# Altium project MKSCANable.PrjPcb
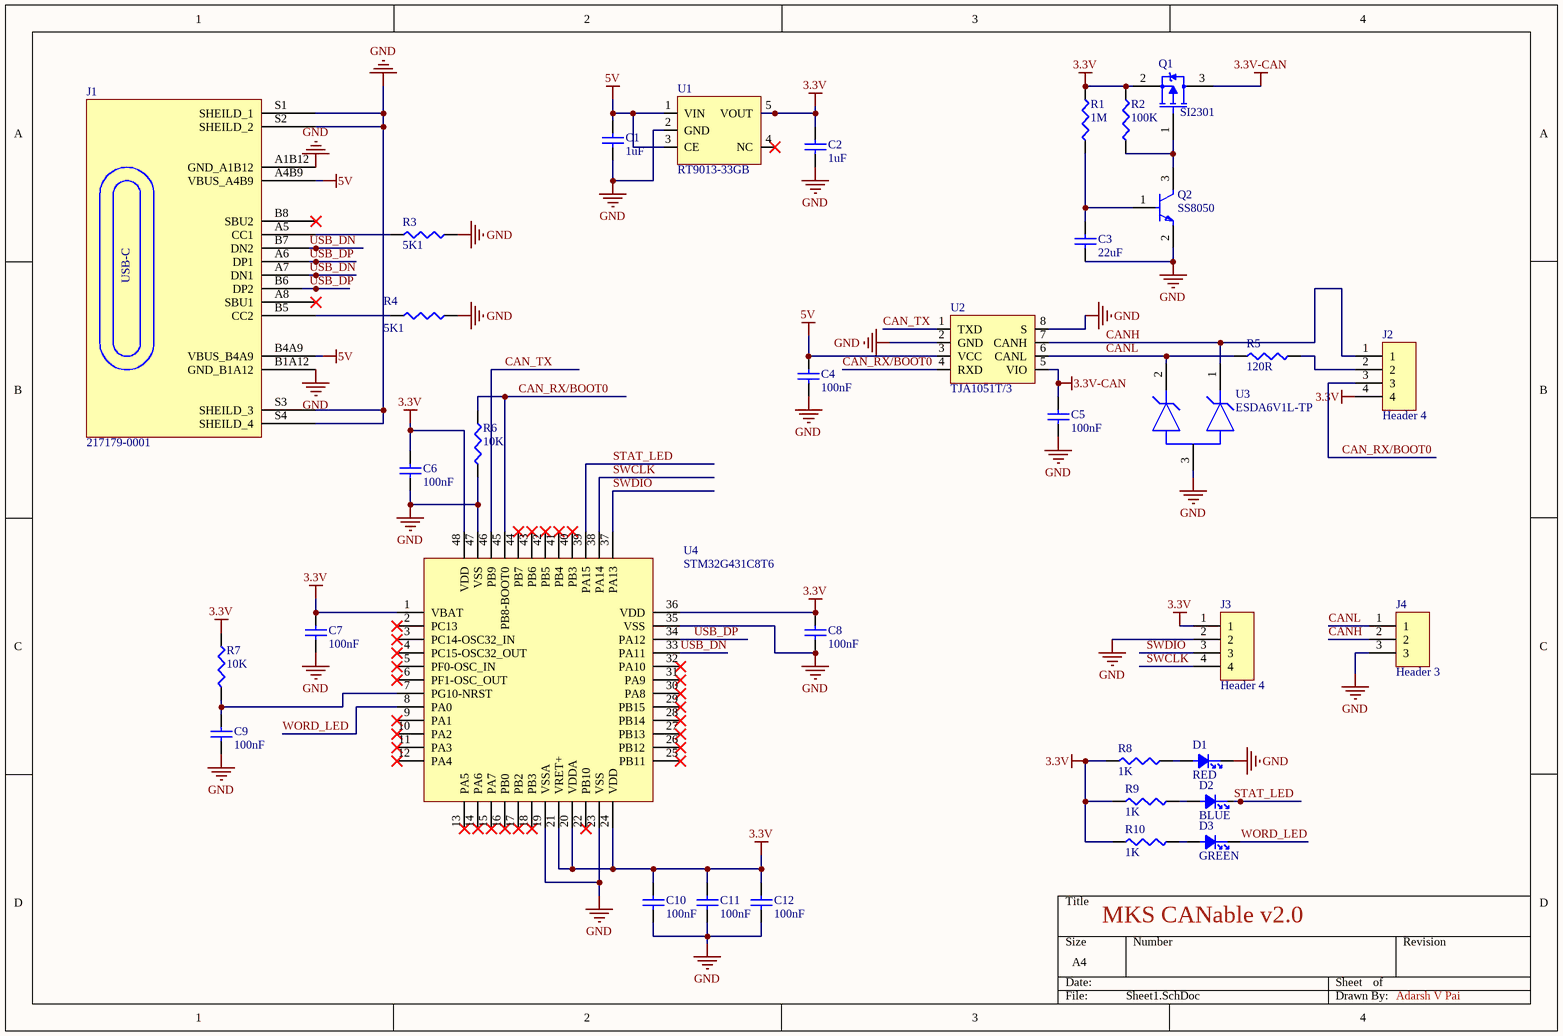
[diagram p0: Sheet1.SchDoc]
1 sheet, 35 parts. Net scope: global (net labels, ports and power ports of the same name join across sheets).
Board file: PCB1.PcbDoc

## Sheet Sheet1.SchDoc
size A4; SheetNumber: 1; SheetTotal: 1

### Parts
C1  1uF  [CAPC1005X55N]
C2  1uF  [CAPC1005X55N]
C3  22uF  [CAPC1005X55N]
C4  100nF  [CAPC1005X55N]
C5  100nF  [CAPC1005X55N]
C6  100nF  [CAPC1005X55N]
C7  100nF  [CAPC1005X55N]
C8  100nF  [CAPC1005X55N]
C9  100nF  [CAPC1005X55N]
C10  100nF  [CAPC1005X55N]
C11  100nF  [CAPC1005X55N]
C12  100nF  [CAPC1005X55N]
D1  RED  [LED0402R]
D2  BLUE  [LED0402B]
D3  GREEN  [LED0402G]
J1  217179-0001  [FP-2171790001-MFG]
J2  Header 4  [HDR_1X4_1.27MM]
J3  Header 4  [HDR_1X4_1.27MM]
J4  Header 3  [HDR_1X3_1.27MM]
Q1  SI2301  [FP-S-03946-IPC_C]
Q2  SS8050  [FP-SS8050-G-IPC_B]
R1  1M  [RESC1005X37N]
R2  100K  [RESC1005X37N]
R3  5K1  [RESC1005X37N]
R4  5K1  [RESC1005X37N]
R5  120R  [RESC1005X37N]
R6  10K  [RESC1005X37N]
R7  10K  [RESC1005X37N]
R8  1K  [RESC1005X37N]
R9  1K  [RESC1005X37N]
R10  1K  [RESC1005X37N]
U1  RT9013-33GB  [RT9013-33GB]
U2  TJA1051T/3  [NXP-SOIC-8_M]
U3  ESDA6V1L-TP  [FP-SOT-23-IPC_B]
U4  STM32G431C8T6  [STM32]

### Nets
3.3V: C2.2 C6.2 C7.2 C8.2 C10.2 C11.2 C12.2 J2.4 J3.1 Q1.2(S) R1.2 R2.2 R7.2 R8.1 R9.1 R10.1 U1.5(VOUT) U4.1(VBAT) U4.20(VDDA) U4.21(VRET+) U4.24(VDD) U4.36(VDD) U4.48(VDD)
3.3V-CAN: C5.2 Q1.3(D) U2.5(VIO)
5V: C1.2 C4.2 J1.A4B9(VBUS_A4B9) J1.B4A9(VBUS_B4A9) U1.1(VIN) U1.3(CE) U2.3(VCC)
GND: C1.1 C2.1 C3.1 C4.1 C5.1 C6.1 C7.1 C8.1 C9.1 C10.1 C11.1 C12.1 D1.1 J1.A1B12(GND_A1B12) J1.B1A12(GND_B1A12) J1.S1(SHEILD_1) J1.S2(SHEILD_2) J1.S3(SHEILD_3) J1.S4(SHEILD_4) J3.2 J4.3 Q2.2(E) R3.2 R4.2 R6.2 U1.2(GND) U2.2(GND) U2.8(S) U3.3 U4.19(VSSA) U4.23(VSS) U4.35(VSS) U4.47(VSS)
CAN_RX/BOOT0: J2.3 R6.1 U2.4(RXD) U4.45(PB8-BOOT0)
CAN_TX: U2.1(TXD) U4.46(PB9)
CANH: J2.1 J4.2 U2.7(CANH) U3.1
CANL: J4.1 R5.1 U2.6(CANL) U3.2
STAT_LED: D2.1 U4.39(PA15)
SWCLK: J3.4 U4.38(PA14)
SWDIO: J3.3 U4.37(PA13)
USB_DN: J1.A7(DN1) J1.B7(DN2) U4.33(PA11)
USB_DP: J1.A6(DP1) J1.B6(DP2) U4.34(PA12)
WORD_LED: D3.1 U4.8(PA0)
NetC3_2: C3.2 Q2.1(B) R1.1
NetC9_2: C9.2 R7.1 U4.7(PG10-NRST)
NetD1_2: D1.2 R8.2
NetD2_2: D2.2 R9.2
NetD3_2: D3.2 R10.2
NetJ1_A5: J1.A5(CC1) R3.1
NetJ1_B5: J1.B5(CC2) R4.1
NetJ2_2: J2.2 R5.2
NetQ1_1: Q1.1(G) Q2.3(C) R2.1

Not connected (* = marked no-connect by the designer): J1 A8(SBU1)* B8(SBU2)*; U1 4(NC)*; U4 2(PC13)* 3(PC14-OSC32_IN)* 4(PC15-OSC32_OUT)* 5(PF0-OSC_IN)* 6(PF1-OSC_OUT)* 9(PA1)* 10(PA2)* 11(PA3)* 12(PA4)* 13(PA5)* 14(PA6)* 15(PA7)* 16(PB0)* 17(PB2)* 18(PB3)* 22(PB10)* 25(PB11)* 26(PB12)* 27(PB13)* 28(PB14)* 29(PB15)* 30(PA8)* 31(PA9)* 32(PA10)* 40(PB3)* 41(PB4)* 42(PB5)* 43(PB6)* 44(PB7)*

### Notes on the sheet
- MKS CANable v2.0
- Adarsh V Pai
- (in symbol 217179-0001) USB-C

### Library data of the parts
C1 C2 = 1uF: Ceramic Capacitor, Multilayer, Ceramic, 50V, 10% +Tol, 10% -Tol, X7R, 15% TC, 1uF, Surface Mount, 1206; Manufacturer: KEMET; Manufacturer Part Number: C1206C105K5RACTU; Multilayer: Yes; Supplier: Digikey; Supplier Part Number: 399-C1206C105K5RAC7800CT-ND; RoHS: Yes; Category: Ceramic Capacitors; Stock: 243208; Pricing: 1=0.28, 10=0.182, 50=0.128, 100=0.1034, 500=0.07684, 1000=0.06724, 2500=0.06403, 5000=0.05923, 12500=0.05315, 25000=0.05123, 62500=0.04803, 125000=0.04242 (USD); Mounting Technology: Surface Mount; Pins: 2; Dielectric Material: Ceramic; Package Shape: Rectangular; Case/Package: 1206; Terminal Finish: Nickel; Min Operating Temperature: -55°C; Max Operating Temperature: 125°C; JESD-609 Code: e3; Value: 1uF; Capacitor Type: Ceramic; Tolerance  (fill in as +-): 10%; Package Style: SMTMeter; Packaging: Tape and Reel; Tolerance (fill in as +-): 10%; Rated DC Voltage (URdc): 50V; Temperature Characteristics Code: X7R; Termination: Wraparound; Length: 3.2mm; Width: 1.6mm; Height: 1mm; Reach SVHC Compliant: Yes; RoHS Compliant: Yes; ComponentLink1URL: https://datasheet.ciiva.com:443/pdfs/VipMasterIC/IC/KEME/KEME-S-A0008991654/KEME-S-A0008991654-1.pdf?src-supplier=IHS+Markit; ComponentLink1Description: https://datasheet.ciiva.com:443/pdfs/VipMasterIC/IC/KEME/KEME-S-A0008991654/KEME-S-A0008991654-1.pdf?src-supplier=IHS+Markit; ComponentLink2URL: https://datasheet.ciiva.com/6074/kem-c1002-x7r-smd-6074697.pdf?src-supplier=Farnell; ComponentLink2Description: https://datasheet.ciiva.com/6074/kem-c1002-x7r-smd-6074697.pdf?src-supplier=Farnell; ComponentLink3URL: https://datasheet.ciiva.com/7730/kem-c1002-x7r-smd-7730086.pdf?src-supplier=Element14; ComponentLink3Description: https://datasheet.ciiva.com/7730/kem-c1002-x7r-smd-7730086.pdf?src-supplier=Element14; ComponentLink4URL: https://datasheet.ciiva.com/22749/1918693-22749725.pdf?src-supplier=Element14; ComponentLink4Description: https://datasheet.ciiva.com/22749/1918693-22749725.pdf?src-supplier=Element14
C3 = 22uF: Ceramic Capacitor, Multilayer, Ceramic, 6.3V, 20% +Tol, 20% -Tol, X5R, 15% TC, 22uF, Surface Mount, 0805; Manufacturer: Murata; Manufacturer Part Number: GRM21BR60J226ME39L; Multilayer: Yes; Supplier: Digikey; Supplier Part Number: 490-1719-1-ND; RoHS: Yes; Category: Ceramic Capacitors; Stock: 3492300; Pricing: 1=0.34, 10=0.198, 50=0.1424, 100=0.1251, 500=0.0956, 1000=0.0864 (USD); Mounting Technology: Surface Mount; Pins: 2; Dielectric Material: Ceramic; Package Shape: Rectangular; Case/Package: 0805; Terminal Finish: Nickel; Min Operating Temperature: -55°C; Max Operating Temperature: 85°C; Value: 22uF; Capacitor Type: Ceramic; Tolerance  (fill in as +-): 20%; Packaging: Tape and Reel; Tolerance (fill in as +-): 20%; Rated DC Voltage (URdc): 6.3V; Termination: Wraparound; JESD-609 Code: e3; Package Style: SMTMeter; Temperature Characteristics Code: X5R; Length: 2mm; Width: 1.25mm; Height: 1.25mm; Reach SVHC Compliant: Yes; RoHS Compliant: Yes; ComponentLink1URL: https://psearch.en.murata.com:443/capacitor/product/GRM21BR60J226ME39%23.pdf?src-supplier=IHS+Markit; ComponentLink1Description: https://psearch.en.murata.com:443/capacitor/product/GRM21BR60J226ME39%23.pdf?src-supplier=IHS+Markit
C4-C12 = 100nF: Ceramic Capacitor, Multilayer, Ceramic, 10V, 10% +Tol, 10% -Tol, X5R, 15% TC, 0.1uF, Surface Mount, 0402; Manufacturer: KEMET; Manufacturer Part Number: C0402C104K8PACTU; Multilayer: Yes; Supplier: Digikey; Supplier Part Number: 399-C0402C104K8PACTUCT-ND; RoHS: Yes; Category: Ceramic Capacitors; Stock: 507186; Pricing: 1=0.1, 10=0.035, 50=0.02, 100=0.0155, 500=0.01166, 1000=0.00917, 2500=0.00833, 5000=0.00767, 10000=0.007, 20000=0.00667, 30000=0.00633, 50000=0.00567, 100000=0.00458, 250000=0.00417 (USD); Mounting Technology: Surface Mount; Pins: 2; Dielectric Material: Ceramic; Package Shape: Rectangular; Case/Package: 0402; Terminal Finish: Nickel; Min Operating Temperature: -55°C; Max Operating Temperature: 85°C; JESD-609 Code: e3; Value: 100nF; Capacitor Type: Ceramic; Tolerance  (fill in as +-): 10%; Package Style: SMTMeter; Packaging: Tape and Reel; Tolerance (fill in as +-): 10%; Rated DC Voltage (URdc): 10V; Termination: Wraparound; Temperature Characteristics Code: X5R; Length: 1mm; Width: 0.5mm; Height: 0.5mm; Reach SVHC Compliant: Yes; RoHS Compliant: Yes; ComponentLink1URL: https://datasheet.ciiva.com:443/pdfs/VipMasterIC/IC/KEME/KEME-S-A0008991665/KEME-S-A0008991665-1.pdf?src-supplier=IHS+Markit; ComponentLink1Description: https://datasheet.ciiva.com:443/pdfs/VipMasterIC/IC/KEME/KEME-S-A0008991665/KEME-S-A0008991665-1.pdf?src-supplier=IHS+Markit; ComponentLink2URL: https://datasheet.ciiva.com/144/docfinderpartnumber-c0402c104k8pactu-144097.pdf?src-supplier=Digikey; ComponentLink2Description: https://datasheet.ciiva.com/144/docfinderpartnumber-c0402c104k8pactu-144097.pdf?src-supplier=Digikey; ComponentLink3URL: https://datasheet.ciiva.com/7747/1776086-7747440.pdf?src-supplier=Element14; ComponentLink3Description: https://datasheet.ciiva.com/7747/1776086-7747440.pdf?src-supplier=Element14; ComponentLink4URL: https://datasheet.ciiva.com/28645/1789732-28645387.pdf?src-supplier=Element14; ComponentLink4Description: https://datasheet.ciiva.com/28645/1789732-28645387.pdf?src-supplier=Element14; ComponentLink5URL: https://datasheet.ciiva.com/14588/70095383-14588187.pdf?src-supplier=Allied+Electronics; ComponentLink5Description: https://datasheet.ciiva.com/14588/70095383-14588187.pdf?src-supplier=Allied+Electronics; ComponentLink6URL: https://datasheet.ciiva.com/14595/70095383-14595064.pdf?src-supplier=Allied+Electronics; ComponentLink6Description: https://datasheet.ciiva.com/14595/70095383-14595064.pdf?src-supplier=Allied+Electronics
D1 = VLMS1500-GS08: LED RED 0402 SMD; Manufacturer: Vishay; Shape: Rectangular; Forward Current: 30mA; Forward Voltage: 2.4V; Luminous Intensity-Nom: 54mcd; Channels: 1; Optoelectronic Device Type: SINGLE COLOR LED; Reverse Voltage-Max: 5V; Viewing Angle: 130°; Overall Height: 0.35mm; Supplier: Digikey; Supplier Part Number: VLMS1500-GS08CT-ND; Manufacturer Part Number: VLMS1500-GS08; RoHS: Yes; Category: LEDs; Stock: 30781; Pricing: 1=0.34, 10=0.265, 100=0.119, 500=0.10746, 1000=0.08827, 3000=0.07676, 6000=0.06908, 15000=0.06141, 30000=0.05757, 75000=0.05181, 150000=0.04989 (USD); Mounting Technology: Surface Mount; Pins: 2; Color: Red; Color@wavelength: Red; Min Operating Temperature: -30°C; Max Operating Temperature: 85°C; Packaging: Tape and Reel; Size: 0.5mm; Terminal Pitch: 0.95mm; Reach SVHC Compliant: Yes; RoHS Compliant: Yes; ComponentLink1URL: https://datasheet.ciiva.com:443/pdfs/VipMasterIC/IC/VISH/VISH-S-A0003457490/VISH-S-A0003457490-1.pdf?src-supplier=IHS+Markit; ComponentLink1Description: https://datasheet.ciiva.com:443/pdfs/VipMasterIC/IC/VISH/VISH-S-A0003457490/VISH-S-A0003457490-1.pdf?src-supplier=IHS+Markit; ComponentLink2URL: http://www.farnell.com/datasheets/1809983.pdf?src-supplier=Farnell; ComponentLink2Description: http://www.farnell.com/datasheets/1809983.pdf?src-supplier=Farnell; ComponentLink3URL: http://www.mouser.com/ds/2/427/vlmo1500-244705.pdf?src-supplier=Mouser; ComponentLink3Description: http://www.mouser.com/ds/2/427/vlmo1500-244705.pdf?src-supplier=Mouser; ComponentLink4URL: http://www.alliedelec.com/m/d/cfc385e1097fc985ee9a50a3551ac188.pdf?src-supplier=Allied+Electronics; ComponentLink4Description: http://www.alliedelec.com/m/d/cfc385e1097fc985ee9a50a3551ac188.pdf?src-supplier=Allied+Electronics; ComponentLink5URL: https://datasheet.octopart.com/VLMS1500-GS08-Vishay-datasheet-62332426.pdf?src-supplier=Newark; ComponentLink5Description: https://datasheet.octopart.com/VLMS1500-GS08-Vishay-datasheet-62332426.pdf?src-supplier=Newark; ComponentLink6URL: https://datasheet.octopart.com/VLMS1500-GS08-Vishay-datasheet-33014519.pdf?src-supplier=Element14; ComponentLink6Description: https://datasheet.octopart.com/VLMS1500-GS08-Vishay-datasheet-33014519.pdf?src-supplier=Element14; ComponentLink7URL: http://datasheet.octopart.com/VLMS1500-GS08-Vishay-datasheet-21227148.pdf?src-supplier=Avnet; ComponentLink7Description: http://datasheet.octopart.com/VLMS1500-GS08-Vishay-datasheet-21227148.pdf?src-supplier=Avnet; ComponentLink8URL: http://www.farnell.com/datasheets/1809983.pdf?src-supplier=Newark; ComponentLink8Description: http://www.farnell.com/datasheets/1809983.pdf?src-supplier=Newark; ComponentLink9URL: http://www.farnell.com/datasheets/2050839.pdf?src-supplier=Newark; ComponentLink9Description: http://www.farnell.com/datasheets/2050839.pdf?src-supplier=Newark; ComponentLink10URL: http://datasheet.octopart.com/VLMS1500-GS08-Vishay-datasheet-21227148.pdf?src-supplier=Quest; ComponentLink10Description: http://datasheet.octopart.com/VLMS1500-GS08-Vishay-datasheet-21227148.pdf?src-supplier=Quest; ComponentLink11URL: http://datasheet.octopart.com/VLMS1500-GS08-Vishay-datasheet-21227148.pdf?src-supplier=NAC+Semi; ComponentLink11Description: http://datasheet.octopart.com/VLMS1500-GS08-Vishay-datasheet-21227148.pdf?src-supplier=NAC+Semi; LCSC Part Number: C511370
D2 = VLMB1500-GS08: Single Color LED, Blue, 0.5mm; Manufacturer: Vishay; Shape: Rectangular; Forward Current: 30mA; Forward Voltage: 3.15V; Luminous Intensity-Nom: 28.1mcd; Channels: 1; Viewing Angle: 130°; Overall Height: 0.35mm; Supplier: Digikey; Supplier Part Number: VLMB1500-GS08CT-ND; Manufacturer Part Number: VLMB1500-GS08; RoHS: Yes; Category: LEDs; Stock: 37691; Pricing: 1=0.39, 10=0.307, 100=0.1378, 500=0.12444, 1000=0.10221, 3000=0.08888, 6000=0.07999, 15000=0.0711, 30000=0.06666, 75000=0.05999, 150000=0.05777 (USD); Mounting Technology: Surface Mount; Pins: 2; Color: Blue; Color@wavelength: Blue; Terminal Finish: Tin; Min Operating Temperature: -30°C; Max Operating Temperature: 85°C; JESD-609 Code: e3; Optoelectronic Device Type: SINGLE COLOR LED; Packaging: Tape and Reel; Size: 0.5mm; Terminal Pitch: 0.95mm; Reach SVHC Compliant: Yes; RoHS Compliant: Yes; ComponentLink1URL: https://datasheet.ciiva.com:443/pdfs/VipMasterIC/IC/VISH/VISH-S-A0003457490/VISH-S-A0003457490-1.pdf?src-supplier=IHS+Markit; ComponentLink1Description: https://datasheet.ciiva.com:443/pdfs/VipMasterIC/IC/VISH/VISH-S-A0003457490/VISH-S-A0003457490-1.pdf?src-supplier=IHS+Markit; ComponentLink2URL: https://datasheet.ciiva.com/30005/vlmo1500-30005132.pdf?src-supplier=Avnet; ComponentLink2Description: https://datasheet.ciiva.com/30005/vlmo1500-30005132.pdf?src-supplier=Avnet
D3 = VLMG1500-GS08: LED YLW-GRN 0402 SMD; Manufacturer: Vishay; Color: Green,Yellow; Shape: Rectangular; Forward Current: 30mA; Forward Voltage: 2.4V; Luminous Intensity-Nom: 90mcd; Channels: 1; Optoelectronic Device Type: SINGLE COLOR LED; Reverse Voltage-Max: 5V; Viewing Angle: 130°; Overall Height: 0.35mm; Supplier: Digikey; Supplier Part Number: VLMG1500-GS08CT-ND; Manufacturer Part Number: VLMG1500-GS08; RoHS: Yes; Category: LEDs; Stock: 93157; Pricing: 1=0.34, 10=0.265, 100=0.119, 500=0.10746, 1000=0.08827 (USD); Mounting Technology: Surface Mount; Pins: 2; Color@wavelength: Green; Min Operating Temperature: -30°C; Max Operating Temperature: 85°C; Packaging: Tape and Reel; Size: 0.5mm; Terminal Pitch: 0.95mm; Reach SVHC Compliant: Yes; RoHS Compliant: Yes; ComponentLink1URL: https://datasheet.ciiva.com:443/pdfs/VipMasterIC/IC/VISH/VISH-S-A0003457490/VISH-S-A0003457490-1.pdf?src-supplier=IHS+Markit; ComponentLink1Description: https://datasheet.ciiva.com:443/pdfs/VipMasterIC/IC/VISH/VISH-S-A0003457490/VISH-S-A0003457490-1.pdf?src-supplier=IHS+Markit; ComponentLink2URL: https://datasheet.ciiva.com/12071/vlmo1500-244705-12071911.pdf?src-supplier=Mouser; ComponentLink2Description: https://datasheet.ciiva.com/12071/vlmo1500-244705-12071911.pdf?src-supplier=Mouser; ComponentLink3URL: https://datasheet.ciiva.com/30005/vlmo1500-30005134.pdf?src-supplier=Avnet; ComponentLink3Description: https://datasheet.ciiva.com/30005/vlmo1500-30005134.pdf?src-supplier=Avnet; LCSC Part Number: C511404
J1 = 217179-0001: CONN RCP USB2.0 TYP C 24P SMD RA; Manufacturer: Molex; Supplier: Digikey; Supplier Part Number: 900-2171790001CT-ND; Manufacturer Part Number: 217179-0001; RoHS: No; Category: USB Connectors; Stock: 14149; Pricing: 1=0.9, 10=0.745, 100=0.6212 (USD); LCSC Part Number: C3197684
J2 J3 = FTS-104-01-F-S: Manufacturer: Samtec; Manufacturer Series: FTS; Connector Type: BOARD CONNECTOR; Option: General Purpose; Filter Feature: No; Number of Rows Loaded: 1; Number of Contacts: 4; Additional Feature: Low Profile; Supplier: Digikey; Supplier Part Number: FTS-104-01-F-S-ND; Manufacturer Part Number: FTS-104-01-F-S; RoHS: Yes; Category: Connectors; Stock: 197; Pricing: 1=0.81, 50=0.7086, 100=0.6004, 500=0.4993, 1000=0.4375 (USD); Mounting Technology: Board; Contact Material: Bronze; Contact Finish - Mating: GOLD (3) OVER NICKEL (50); Contact Finish - Termination: Matte Tin (Sn) - with Nickel (Ni) barrier; JESD-609 Code: e3; Contact Gender: Male; Mixed Contacts: No; Mounting Style: STRAIGHT; Termination: Solder; Terminal Pitch: 1.27mm; Flammability Rating: UL94 V-0; DIN Conformance: No; IEC Conformance: No; MIL Conformance: No; Reach SVHC Compliant: Yes; RoHS Compliant: Yes; ComponentLink1URL: https://datasheet.ciiva.com:443/pdfs/VipMasterIC/IC/SAMI/SAMI-S-A0001504673/SAMI-S-A0001504673-1.pdf?src-supplier=IHS+Markit; ComponentLink1Description: https://datasheet.ciiva.com:443/pdfs/VipMasterIC/IC/SAMI/SAMI-S-A0001504673/SAMI-S-A0001504673-1.pdf?src-supplier=IHS+Markit; ComponentLink2URL: https://datasheet.octopart.com/FTS-104-01-F-S-Samtec-datasheet-151470456.pdf?src-supplier=Farnell; ComponentLink2Description: https://datasheet.octopart.com/FTS-104-01-F-S-Samtec-datasheet-151470456.pdf?src-supplier=Farnell; ComponentLink3URL: http://www.samtec.com/documents/webfiles/pdf/FTS.pdf?src-supplier=Avnet; ComponentLink3Description: http://www.samtec.com/documents/webfiles/pdf/FTS.pdf?src-supplier=Avnet
J4 = FTS-103-01-F-S: Manufacturer: Samtec; Manufacturer Series: FTS; Connector Type: BOARD CONNECTOR; Option: General Purpose; Additional Feature: Low Profile; Filter Feature: No; Number of Rows Loaded: 1; Number of Contacts: 3; Supplier: Digikey; Supplier Part Number: 612-FTS-103-01-F-S-ND; Manufacturer Part Number: FTS-103-01-F-S; RoHS: Yes; Category: Connectors; Stock: 2922; Pricing: 1=0.73, 50=0.6378, 100=0.5407, 500=0.4491, 1000=0.4 (USD); Mounting Technology: Board; Contact Material: Bronze; Contact Finish - Mating: GOLD (3) OVER NICKEL (50); Contact Finish - Termination: Matte Tin (Sn) - with Nickel (Ni) barrier; JESD-609 Code: e3; Contact Gender: Male; Mixed Contacts: No; Mounting Style: STRAIGHT; Termination: Solder; Terminal Pitch: 1.27mm; Flammability Rating: UL94 V-0; DIN Conformance: No; IEC Conformance: No; MIL Conformance: No; Reach SVHC Compliant: Yes; RoHS Compliant: Yes; ComponentLink1URL: https://datasheet.ciiva.com:443/pdfs/VipMasterIC/IC/SAMI/SAMI-S-A0001504673/SAMI-S-A0001504673-1.pdf?src-supplier=IHS+Markit; ComponentLink1Description: https://datasheet.ciiva.com:443/pdfs/VipMasterIC/IC/SAMI/SAMI-S-A0001504673/SAMI-S-A0001504673-1.pdf?src-supplier=IHS+Markit; ComponentLink2URL: http://suddendocs.samtec.com/prints/fts-1xx-xx-xx-xx-xx-mkt.pdf?src-supplier=Digikey; ComponentLink2Description: http://suddendocs.samtec.com/prints/fts-1xx-xx-xx-xx-xx-mkt.pdf?src-supplier=Digikey; ComponentLink3URL: http://www.samtec.com/documents/webfiles/pdf/FTS.pdf?src-supplier=Avnet; ComponentLink3Description: http://www.samtec.com/documents/webfiles/pdf/FTS.pdf?src-supplier=Avnet; ComponentLink4URL: https://datasheet.octopart.com/FTS-103-01-F-S-Samtec-datasheet-116535195.pdf?src-supplier=Toby+Electronics; ComponentLink4Description: https://datasheet.octopart.com/FTS-103-01-F-S-Samtec-datasheet-116535195.pdf?src-supplier=Toby+Electronics; ComponentLink5URL: https://datasheet.octopart.com/FTS-103-01-F-S-Samtec-datasheet-151470456.pdf?src-supplier=Sager+Electronics; ComponentLink5Description: https://datasheet.octopart.com/FTS-103-01-F-S-Samtec-datasheet-151470456.pdf?src-supplier=Sager+Electronics
Q1 = SI2301BDS-T1-GE3: Small Signal Field-Effect Transistor, 2.2A I(D), 20V, 1-Element, P-Channel, Silicon, Metal-oxide Semiconductor FET, TO-236AB; Manufacturer: Vishay Siliconix; Package Body Material: Plastic; Drain-source On Resistance-Max: 100mR; Number of Elements: 1; Operating Mode: ENHANCEMENT MODE; Time @ Peak Reflow Temperature-Max (s): 30s; Power Dissipation-Max (Abs): 900mW; Qualification Status: Not Qualified; Supplier: Digikey; Supplier Part Number: SI2301BDS-T1-GE3CT-ND; Manufacturer Part Number: SI2301BDS-T1-GE3; RoHS: Yes; Category: MOSFETs; Stock: 20019; Pricing: 1=0.76, 10=0.472, 100=0.2632, 500=0.2151, 1000=0.18617 (USD); Pins: 3; Package Shape: Rectangular; Terminal Finish: Tin; Transistor Element Material: SILICON; Max Operating Temperature: 150°C; JESD-609 Code: e3; Polarity/Channel Type: P-CHANNEL; Drain Current-Max (ID): 2.2A; DS Breakdown Voltage-Min: 20V; FET Technology: METAL-OXIDE SEMICONDUCTOR; JESD-30 Code: R-PDSO-G3; Moisture Sensitivity Level: 1; Package Style: SMALL OUTLINEMeter; Peak Reflow Temperature (Cel): 260°C; Surface Mount: Yes; Terminal Form: Gull Wing; Terminal Position: DUAL; Drain Current-Max (Abs) (ID): 2.2A; Reach SVHC Compliant: Yes; RoHS Compliant: Yes; JEDEC-95 Code: TO-236AB; ComponentLink1URL: https://datasheet.ciiva.com:443/pdfs/VipMasterIC/IC/VISH/VISHS84963/VISHS84963-1.pdf?src-supplier=IHS+Markit; ComponentLink1Description: https://datasheet.ciiva.com:443/pdfs/VipMasterIC/IC/VISH/VISHS84963/VISHS84963-1.pdf?src-supplier=IHS+Markit; ComponentLink2URL: https://datasheet.ciiva.com/11160/si2301bds-11160977.pdf?src-supplier=Avnet; ComponentLink2Description: https://datasheet.ciiva.com/11160/si2301bds-11160977.pdf?src-supplier=Avnet; ComponentLink3URL: https://datasheet.ciiva.com/7789/si2301bds-7789014.pdf?src-supplier=Element14; ComponentLink3Description: https://datasheet.ciiva.com/7789/si2301bds-7789014.pdf?src-supplier=Element14; ComponentLink4URL: https://datasheet.ciiva.com/944/si2301bds-944179.pdf?src-supplier=Digikey; ComponentLink4Description: https://datasheet.ciiva.com/944/si2301bds-944179.pdf?src-supplier=Digikey; ComponentLink5URL: https://datasheet.ciiva.com/16486/si2301bds-16486235.pdf?src-supplier=Future+Electronics; ComponentLink5Description: https://datasheet.ciiva.com/16486/si2301bds-16486235.pdf?src-supplier=Future+Electronics
Q2 = SS8050: Small Signal Bipolar Transistor, 1.5A I(C), 25V V(BR)CEO, 1-Element, NPN, Silicon, TO-92; Manufacturer: ON Semiconductor / Fairchild; Manufacturer Part Number: SS8050DBU; Package Body Material: Plastic; DC Current Gain-Min (hFE): 160; Number of Elements: 1; Power Dissipation-Max (Abs): 1W; Surface Mount: No; Transistor Application: AMPLIFIER; Frequency: 190MHz; Qualification Status: Not Qualified; Supplier: Digikey; Supplier Part Number: SS8050DBU-ND; RoHS: Yes; Category: BJTs; Stock: 3759; Pricing: 1=0.42, 10=0.322, 100=0.1933, 500=0.17902, 1000=0.12174, 2000=0.11207, 5000=0.10741, 10000=0.09667, 50000=0.08951 (USD); Pins: 3; Package Shape: Round; Transistor Element Material: SILICON; Max Operating Temperature: 150°C; Package Style: CYLINDRICALMeter; Polarity/Channel Type: NPN; Max Collector Current: 1.5A; Collector-emitter Voltage-Max: 25V; JESD-30 Code: O-PBCY-T3; Terminal Form: Through Hole; Terminal Position: BOTTOM; Reach SVHC Compliant: Yes; RoHS Compliant: Yes; JEDEC-95 Code: TO-92; ComponentLink1URL: https://datasheet.ciiva.com:443/pdfs/VipMasterIC/IC/ONSM/ONSM-S-A0003589354/ONSM-S-A0003589354-1.pdf?src-supplier=IHS+Markit; ComponentLink1Description: https://datasheet.ciiva.com:443/pdfs/VipMasterIC/IC/ONSM/ONSM-S-A0003589354/ONSM-S-A0003589354-1.pdf?src-supplier=IHS+Markit; ComponentLink2URL: https://datasheet.ciiva.com/19482/1090757-19482669.pdf?src-supplier=Jameco; ComponentLink2Description: https://datasheet.ciiva.com/19482/1090757-19482669.pdf?src-supplier=Jameco; ComponentLink3URL: https://datasheet.ciiva.com/46415/1868828-46415607.pdf?src-supplier=Element14; ComponentLink3Description: https://datasheet.ciiva.com/46415/1868828-46415607.pdf?src-supplier=Element14; ComponentLink4URL: https://datasheet.ciiva.com/4722/ss8050-117753-4722682.pdf?src-supplier=Mouser; ComponentLink4Description: https://datasheet.ciiva.com/4722/ss8050-117753-4722682.pdf?src-supplier=Mouser; ComponentLink5URL: https://datasheet.ciiva.com/979/ss8050-979045.pdf?src-supplier=Digikey; ComponentLink5Description: https://datasheet.ciiva.com/979/ss8050-979045.pdf?src-supplier=Digikey; ComponentLink6URL: https://datasheet.ciiva.com/11201/ss8050-11201596.pdf?src-supplier=Avnet; ComponentLink6Description: https://datasheet.ciiva.com/11201/ss8050-11201596.pdf?src-supplier=Avnet
R1 = 1M: Fixed Resistor, Metal Glaze/thick Film, 0.1W, 1000000ohm, 75V, 1% +/-Tol, 100ppm/Cel, Surface Mount, 0603; Manufacturer: Panasonic; Manufacturer Part Number: ERJ-3EKF1004V; Power: 100mW; Rated Temperature: 70°C; Value: 1MR; Temperature Coefficient: 100ppm/°C; Package Height: 0.45mm; Package Length: 1.6mm; Package Width: 0.8mm; Reference Standard: AEC-Q200; Supplier: Digikey; Supplier Part Number: P1.00MHDKR-ND; RoHS: Yes; Category: Chip SMD Resistors; Stock: 334097; Pricing: 1=0.1, 10=0.03, 50=0.0194, 100=0.0163, 500=0.01132, 1000=0.0098 (USD); Mounting Technology: Surface Mount; Pins: 2; Package Shape: Rectangular; Case/Package: 0603; Terminal Finish: Nickel; Min Operating Temperature: -55°C; Max Operating Temperature: 155°C; Tolerance: 1%; Resistor Type: FIXED RESISTOR; JESD-609 Code: e3; Construction: Rectangular; Package Style: SMTMeter; Packaging: Tape and Reel; Technology: METAL GLAZE/THICK FILM; Termination: Wraparound; Working Voltage: 75V; Reach SVHC Compliant: Yes; RoHS Compliant: Yes; ComponentLink1URL: https://datasheet.ciiva.com:443/pdfs/VipMasterIC/IC/PANA/PANA-S-A0009889626/PANA-S-A0009889626-1.pdf?src-supplier=IHS+Markit; ComponentLink1Description: https://datasheet.ciiva.com:443/pdfs/VipMasterIC/IC/PANA/PANA-S-A0009889626/PANA-S-A0009889626-1.pdf?src-supplier=IHS+Markit; ComponentLink2URL: http://www.farnell.com/datasheets/1911175.pdf?src-supplier=Farnell; ComponentLink2Description: http://www.farnell.com/datasheets/1911175.pdf?src-supplier=Farnell; ComponentLink3URL: http://www.farnell.com/datasheets/1678782.pdf?src-supplier=Farnell; ComponentLink3Description: http://www.farnell.com/datasheets/1678782.pdf?src-supplier=Farnell; ComponentLink4URL: http://www.mouser.com/ds/2/315/AOA0000CE2-37512.pdf?src-supplier=Mouser; ComponentLink4Description: http://www.mouser.com/ds/2/315/AOA0000CE2-37512.pdf?src-supplier=Mouser; ComponentLink5URL: http://www.alliedelec.com/m/d/623f45ff1957d936ff56d46fd1c28cac.pdf?src-supplier=Allied+Electronics; ComponentLink5Description: http://www.alliedelec.com/m/d/623f45ff1957d936ff56d46fd1c28cac.pdf?src-supplier=Allied+Electronics; ComponentLink6URL: http://components.arrow.com/part/dataview/3985224S9849817N1386?src-supplier=Arrow+Electronics; ComponentLink6Description: http://components.arrow.com/part/dataview/3985224S9849817N1386?src-supplier=Arrow+Electronics; ComponentLink7URL: https://datasheet.octopart.com/ERJ-3EKF1004V-Panasonic-datasheet-10025800.pdf?src-supplier=Element14; ComponentLink7Description: https://datasheet.octopart.com/ERJ-3EKF1004V-Panasonic-datasheet-10025800.pdf?src-supplier=Element14; ComponentLink8URL: https://datasheet.octopart.com/ERJ-3EKF1004V-Panasonic-datasheet-136608610.pdf?src-supplier=Farnell; ComponentLink8Description: https://datasheet.octopart.com/ERJ-3EKF1004V-Panasonic-datasheet-136608610.pdf?src-supplier=Farnell; ComponentLink9URL: http://www.farnell.com/datasheets/1911175.pdf?src-supplier=Element14; ComponentLink9Description: http://www.farnell.com/datasheets/1911175.pdf?src-supplier=Element14; ComponentLink10URL: http://www.farnell.com/datasheets/1911175.pdf?src-supplier=Newark; ComponentLink10Description: http://www.farnell.com/datasheets/1911175.pdf?src-supplier=Newark; ComponentLink11URL: http://industrial.panasonic.com/cdbs/www-data/pdf/RDA0000/AOA0000C304.pdf?src-supplier=Newark; ComponentLink11Description: http://industrial.panasonic.com/cdbs/www-data/pdf/RDA0000/AOA0000C304.pdf?src-supplier=Newark; ComponentLink12URL: https://datasheet.octopart.com/ERJ-3EKF1004V-Panasonic-datasheet-48891056.pdf?src-supplier=Newark; ComponentLink12Description: https://datasheet.octopart.com/ERJ-3EKF1004V-Panasonic-datasheet-48891056.pdf?src-supplier=Newark
R2 = 100K: NTC Thermistor, 100000ohm, Surface Mount; Manufacturer: Vishay BCcomponents; Manufacturer Part Number: NTCS0603E3104GXT; Tolerance: 2%; Power: 125mW; Rated Temperature: 25°C; Value: 100kR; Thermistor Application: OVERLOAD PROTECTION; Supplier: Digikey; Supplier Part Number: BC2476CT-ND; RoHS: Yes; Category: Thermistors; Stock: 40222; Pricing: 1=0.94, 10=0.716, 25=0.6168, 50=0.5948, 100=0.5067, 500=0.44064, 1000=0.38555 (USD); Mounting Technology: Surface Mount; Pins: 2; Terminal Finish: Tin; Package Shape: Rectangular; Min Operating Temperature: -40°C; Max Operating Temperature: 150°C; JESD-609 Code: e3; Termination: Wraparound; Resistor Type: NTC THERMISTOR; Manufacturer Series: NTCS0603E3104GXT; Packaging: Tape and Reel; Terminal Placement: Dual Ended; RoHS Compliant: Yes; Reach SVHC Compliant: Yes; ComponentLink1URL: https://datasheet.ciiva.com:443/pdfs/VipMasterIC/IC/BEYS/BEYSS04817/BEYSS04817-1.pdf?src-supplier=IHS+Markit; ComponentLink1Description: https://datasheet.ciiva.com:443/pdfs/VipMasterIC/IC/BEYS/BEYSS04817/BEYSS04817-1.pdf?src-supplier=IHS+Markit; ComponentLink2URL: https://datasheet.ciiva.com/2848/ntcs0603-2848786.pdf?src-supplier=Digikey; ComponentLink2Description: https://datasheet.ciiva.com/2848/ntcs0603-2848786.pdf?src-supplier=Digikey; ComponentLink3URL: https://datasheet.ciiva.com/2848/ntcs0603-2848787.pdf?src-supplier=Digikey; ComponentLink3Description: https://datasheet.ciiva.com/2848/ntcs0603-2848787.pdf?src-supplier=Digikey; ComponentLink4URL: https://datasheet.ciiva.com/2848/ntcs0603-2848785.pdf?src-supplier=Digikey; ComponentLink4Description: https://datasheet.ciiva.com/2848/ntcs0603-2848785.pdf?src-supplier=Digikey; ComponentLink5URL: https://datasheet.ciiva.com/8695/ntcs0603-8695743.pdf?src-supplier=Avnet; ComponentLink5Description: https://datasheet.ciiva.com/8695/ntcs0603-8695743.pdf?src-supplier=Avnet
R3 = 5K1: RES SMD 5.1K OHM 1% 1/16W 0402; Manufacturer: Yageo; Manufacturer Part Number: AC0402FR-075K1L; Additional Feature: LASER TRIMMABLE; Power: 62.5mW; Rated Temperature: 70°C; Value: 5.1kR; Temperature Coefficient: 100ppm/°C; Working Voltage: 50V; Package Height: 0.32mm; Package Length: 1mm; Package Width: 0.5mm; Reference Standard: AEC-Q200; Supplier: Digikey; Supplier Part Number: YAG3503CT-ND; RoHS: Yes; Category: Chip SMD Resistors; Stock: 82072; Pricing: 1=0.1, 10=0.019, 50=0.0116, 100=0.0095, 500=0.00638, 1000=0.00544, 5000=0.00391 (USD); Mounting Technology: Surface Mount; Pins: 2; Package Shape: Rectangular; Case/Package: 0402; Terminal Finish: Nickel; Min Operating Temperature: -55°C; Max Operating Temperature: 155°C; Tolerance: 1%; JESD-609 Code: e3; Resistor Type: FIXED RESISTOR; Construction: Chip; Package Style: SMTMeter; Packaging: Tape and Reel; Technology: METAL GLAZE/THICK FILM; Termination: Wraparound; Reach SVHC Compliant: Yes; RoHS Compliant: Yes; ComponentLink1URL: https://datasheet.ciiva.com:443/pdfs/VipMasterIC/IC/YAGO/YAGO-S-A0003597364/YAGO-S-A0003597364-1.pdf?src-supplier=IHS+Markit; ComponentLink1Description: https://datasheet.ciiva.com:443/pdfs/VipMasterIC/IC/YAGO/YAGO-S-A0003597364/YAGO-S-A0003597364-1.pdf?src-supplier=IHS+Markit; ComponentLink2URL: https://datasheet.octopart.com/AC0402FR-075K1L-Yageo-datasheet-166720450.pdf?src-supplier=Future+Electronics; ComponentLink2Description: https://datasheet.octopart.com/AC0402FR-075K1L-Yageo-datasheet-166720450.pdf?src-supplier=Future+Electronics; ComponentLink3URL: http://www.yageo.com/documents/recent/PYu-AC_51_RoHS_L_2_revised.pdf?src-supplier=Future+Electronics; ComponentLink3Description: http://www.yageo.com/documents/recent/PYu-AC_51_RoHS_L_2_revised.pdf?src-supplier=Future+Electronics; LCSC Part Number: C144745
R4 = AC0402FR-075K1L: RES SMD 5.1K OHM 1% 1/16W 0402; Manufacturer: Yageo; Additional Feature: LASER TRIMMABLE; Power: 62.5mW; Rated Temperature: 70°C; Value: 5.1kR; Temperature Coefficient: 100ppm/°C; Working Voltage: 50V; Package Height: 0.32mm; Package Length: 1mm; Package Width: 0.5mm; Reference Standard: AEC-Q200; Supplier: Digikey; Supplier Part Number: YAG3503CT-ND; Manufacturer Part Number: AC0402FR-075K1L; RoHS: Yes; Category: Chip SMD Resistors; Stock: 82072; Pricing: 1=0.1, 10=0.019, 50=0.0116, 100=0.0095, 500=0.00638, 1000=0.00544, 5000=0.00391 (USD); Mounting Technology: Surface Mount; Pins: 2; Package Shape: Rectangular; Case/Package: 0402; Terminal Finish: Nickel; Min Operating Temperature: -55°C; Max Operating Temperature: 155°C; Tolerance: 1%; JESD-609 Code: e3; Resistor Type: FIXED RESISTOR; Construction: Chip; Package Style: SMTMeter; Packaging: Tape and Reel; Technology: METAL GLAZE/THICK FILM; Termination: Wraparound; Reach SVHC Compliant: Yes; RoHS Compliant: Yes; ComponentLink1URL: https://datasheet.ciiva.com:443/pdfs/VipMasterIC/IC/YAGO/YAGO-S-A0003597364/YAGO-S-A0003597364-1.pdf?src-supplier=IHS+Markit; ComponentLink1Description: https://datasheet.ciiva.com:443/pdfs/VipMasterIC/IC/YAGO/YAGO-S-A0003597364/YAGO-S-A0003597364-1.pdf?src-supplier=IHS+Markit; ComponentLink2URL: https://datasheet.octopart.com/AC0402FR-075K1L-Yageo-datasheet-166720450.pdf?src-supplier=Future+Electronics; ComponentLink2Description: https://datasheet.octopart.com/AC0402FR-075K1L-Yageo-datasheet-166720450.pdf?src-supplier=Future+Electronics; ComponentLink3URL: http://www.yageo.com/documents/recent/PYu-AC_51_RoHS_L_2_revised.pdf?src-supplier=Future+Electronics; ComponentLink3Description: http://www.yageo.com/documents/recent/PYu-AC_51_RoHS_L_2_revised.pdf?src-supplier=Future+Electronics; LCSC Part Number: C144745
R5 = 120R: Fixed Resistor, Metal Glaze/thick Film, 0.063W, 120ohm, 50V, 1% +/-Tol, 100ppm/Cel, Surface Mount, 0402; Manufacturer: Vishay; Manufacturer Part Number: CRCW0402120RFKED; Power: 63mW; Temperature Coefficient: 100ppm/°C; Rated Temperature: 70°C; Package Height: 0.35mm; Package Length: 1mm; Package Width: 0.5mm; Reference Standard: AEC-Q200; Supplier: Digikey; Supplier Part Number: 541-120LCT-ND; RoHS: Yes; Category: Chip SMD Resistors; Stock: 131111; Pricing: 1=0.1, 10=0.026, 50=0.0164, 100=0.0137, 500=0.00934, 1000=0.00806, 5000=0.00591 (USD); Mounting Technology: Surface Mount; Pins: 2; Case/Package: 0402; Terminal Finish: Nickel; Package Shape: Rectangular; Min Operating Temperature: -55°C; Max Operating Temperature: 155°C; Tolerance: 1%; Resistor Type: FIXED RESISTOR; Construction: Chip; Package Style: SMTMeter; Value: 120R; Technology: METAL GLAZE/THICK FILM; Working Voltage: 50V; JESD-609 Code: e3; Packaging: Tape and Reel; Termination: Wraparound; RoHS Compliant: Yes; Reach SVHC Compliant: Yes; ComponentLink1URL: https://datasheet.ciiva.com:443/pdfs/VipMasterIC/IC/VISH/VISH-S-A0007266705/VISH-S-A0007266705-1.pdf?src-supplier=IHS+Markit; ComponentLink1Description: https://datasheet.ciiva.com:443/pdfs/VipMasterIC/IC/VISH/VISH-S-A0007266705/VISH-S-A0007266705-1.pdf?src-supplier=IHS+Markit; ComponentLink2URL: https://datasheet.ciiva.com/11817/0900766b80d98824-11817989.pdf?src-supplier=Rs; ComponentLink2Description: https://datasheet.ciiva.com/11817/0900766b80d98824-11817989.pdf?src-supplier=Rs; ComponentLink3URL: https://datasheet.ciiva.com/2463/dcrcwe3-2463109.pdf?src-supplier=Digikey; ComponentLink3Description: https://datasheet.ciiva.com/2463/dcrcwe3-2463109.pdf?src-supplier=Digikey; ComponentLink4URL: https://datasheet.ciiva.com/2463/dcrcwe3-2463110.pdf?src-supplier=Digikey; ComponentLink4Description: https://datasheet.ciiva.com/2463/dcrcwe3-2463110.pdf?src-supplier=Digikey; ComponentLink5URL: https://datasheet.ciiva.com/2463/dcrcwe3-2463111.pdf?src-supplier=Digikey; ComponentLink5Description: https://datasheet.ciiva.com/2463/dcrcwe3-2463111.pdf?src-supplier=Digikey; ComponentLink6URL: https://datasheet.ciiva.com/8336/dcrcwe3-8336661.pdf?src-supplier=Avnet; ComponentLink6Description: https://datasheet.ciiva.com/8336/dcrcwe3-8336661.pdf?src-supplier=Avnet; ComponentLink7URL: https://datasheet.ciiva.com/3256/dcrcwe3-3256009.pdf?src-supplier=Avnet; ComponentLink7Description: https://datasheet.ciiva.com/3256/dcrcwe3-3256009.pdf?src-supplier=Avnet; ComponentLink8URL: https://datasheet.ciiva.com/5550/dcrcwe3-109170-5550502.pdf?src-supplier=Mouser; ComponentLink8Description: https://datasheet.ciiva.com/5550/dcrcwe3-109170-5550502.pdf?src-supplier=Mouser; ComponentLink9URL: https://datasheet.ciiva.com/22674/1912744-22674687.pdf?src-supplier=Element14; ComponentLink9Description: https://datasheet.ciiva.com/22674/1912744-22674687.pdf?src-supplier=Element14; ComponentLink10URL: https://datasheet.ciiva.com/7777/1697337-7777194.pdf?src-supplier=Element14; ComponentLink10Description: https://datasheet.ciiva.com/7777/1697337-7777194.pdf?src-supplier=Element14; ComponentLink11URL: https://datasheet.ciiva.com/7777/1697337-7777195.pdf?src-supplier=Element14; ComponentLink11Description: https://datasheet.ciiva.com/7777/1697337-7777195.pdf?src-supplier=Element14; ComponentLink12URL: https://datasheet.ciiva.com/16199/dcrcwe3-16199070.pdf?src-supplier=Future+Electronics; ComponentLink12Description: https://datasheet.ciiva.com/16199/dcrcwe3-16199070.pdf?src-supplier=Future+Electronics
R6 R7 = AC0402FR-0710KL: RES SMD 10K OHM 1% 1/16W 0402; Manufacturer: Yageo; Additional Feature: LASER TRIMMABLE; Power: 62.5mW; Rated Temperature: 70°C; Value: 10kR; Temperature Coefficient: 100ppm/°C; Working Voltage: 50V; Package Height: 0.32mm; Package Length: 1mm; Package Width: 0.5mm; Reference Standard: AEC-Q200; Supplier: Digikey; Supplier Part Number: YAG3436CT-ND; Manufacturer Part Number: AC0402FR-0710KL; RoHS: Yes; Category: Chip SMD Resistors; Stock: 2309318; Pricing: 1=0.1, 10=0.019, 50=0.0116, 100=0.0095, 500=0.00638, 1000=0.00544, 5000=0.00391 (USD); Mounting Technology: Surface Mount; Pins: 2; Package Shape: Rectangular; Case/Package: 0402; Terminal Finish: Nickel; Min Operating Temperature: -55°C; Max Operating Temperature: 155°C; Tolerance: 1%; JESD-609 Code: e3; Resistor Type: FIXED RESISTOR; Construction: Chip; Package Style: SMTMeter; Packaging: Tape and Reel; Technology: METAL GLAZE/THICK FILM; Termination: Wraparound; Reach SVHC Compliant: Yes; RoHS Compliant: Yes; ComponentLink1URL: https://datasheet.ciiva.com:443/pdfs/VipMasterIC/IC/YAGO/YAGO-S-A0003597364/YAGO-S-A0003597364-1.pdf?src-supplier=IHS+Markit; ComponentLink1Description: https://datasheet.ciiva.com:443/pdfs/VipMasterIC/IC/YAGO/YAGO-S-A0003597364/YAGO-S-A0003597364-1.pdf?src-supplier=IHS+Markit; ComponentLink2URL: https://datasheet.ciiva.com/12656/pyu-ac-51-rohs-l-2-12656634.pdf?src-supplier=Mouser; ComponentLink2Description: https://datasheet.ciiva.com/12656/pyu-ac-51-rohs-l-2-12656634.pdf?src-supplier=Mouser; LCSC PArt Number: C144807
R8-R10 = 1K: RES 1K OHM 1% 1/16W 0402; Manufacturer: Yageo; Manufacturer Part Number: RC0402FR-071KL; Additional Feature: LASER TRIMMABLE; Power: 62.5mW; Rated Temperature: 70°C; Value: 1kR; Temperature Coefficient: 100ppm/°C; Working Voltage: 50V; Package Height: 0.35mm; Package Length: 1mm; Package Width: 0.5mm; Supplier: Digikey; Supplier Part Number: 311-1.00KLRCT-ND; RoHS: Yes; Category: Chip SMD Resistors; Stock: 7208252; Pricing: 1=0.1, 10=0.015, 50=0.0088, 100=0.0073, 500=0.00488, 1000=0.00417, 5000=0.00297 (USD); Mounting Technology: Surface Mount; Pins: 2; Package Shape: Rectangular; Case/Package: 0402; Terminal Finish: Nickel; Min Operating Temperature: -55°C; Max Operating Temperature: 155°C; Tolerance: 1%; JESD-609 Code: e3; Resistor Type: FIXED RESISTOR; Construction: Chip; Package Style: SMTMeter; Packaging: Tape and Reel; Technology: METAL GLAZE/THICK FILM; Termination: Wraparound; Reach SVHC Compliant: Yes; RoHS Compliant: Yes; ComponentLink1URL: https://datasheet.ciiva.com:443/pdfs/VipMasterIC/IC/YAGO/YAGO-S-A0008145938/YAGO-S-A0008145938-1.pdf?src-supplier=IHS+Markit; ComponentLink1Description: https://datasheet.ciiva.com:443/pdfs/VipMasterIC/IC/YAGO/YAGO-S-A0008145938/YAGO-S-A0008145938-1.pdf?src-supplier=IHS+Markit; ComponentLink2URL: https://datasheet.ciiva.com/11819/0900766b80c66297-11819477.pdf?src-supplier=Rs; ComponentLink2Description: https://datasheet.ciiva.com/11819/0900766b80c66297-11819477.pdf?src-supplier=Rs; ComponentLink3URL: https://datasheet.ciiva.com/22747/1018594-22747513.pdf?src-supplier=Element14; ComponentLink3Description: https://datasheet.ciiva.com/22747/1018594-22747513.pdf?src-supplier=Element14; ComponentLink4URL: https://datasheet.ciiva.com/12666/pyu-rc0402-51-rohs-l-6-r-12666741.pdf?src-supplier=Mouser; ComponentLink4Description: https://datasheet.ciiva.com/12666/pyu-rc0402-51-rohs-l-6-r-12666741.pdf?src-supplier=Mouser; ComponentLink5URL: https://datasheet.ciiva.com/17063/pyu-rc0402-51-rohs-l-6-r-17063193.pdf?src-supplier=Future+Electronics; ComponentLink5Description: https://datasheet.ciiva.com/17063/pyu-rc0402-51-rohs-l-6-r-17063193.pdf?src-supplier=Future+Electronics; LCSC Part Number: C106235
U1 = RT9013-33GB: Regulator; Manufacturer: Richtek; Supplier: Digikey; Supplier Part Number: 1028-RT9013-33GBCT-ND; Manufacturer Part Number: RT9013-33GB; RoHS: Yes; Category: Voltage Regulators - Linear; Stock: 6493; Pricing: 1=0.98, 10=0.608, 25=0.5096, 100=0.398, 250=0.34312, 500=0.30952, 1000=0.2815 (USD); ComponentLink1URL: https://datasheet.ciiva.com:443/pdfs/VipMasterIC/IC/RHTK/RHTKS00451/RHTKS00451-1.pdf?src-supplier=IHS+Markit; ComponentLink1Description: https://datasheet.ciiva.com:443/pdfs/VipMasterIC/IC/RHTK/RHTKS00451/RHTKS00451-1.pdf?src-supplier=IHS+Markit; ComponentLink2URL: https://datasheet.ciiva.com/24155/rt9013-12gb-24155563.pdf?src-supplier=Future+Electronics; ComponentLink2Description: https://datasheet.ciiva.com/24155/rt9013-12gb-24155563.pdf?src-supplier=Future+Electronics; ComponentLink3URL: https://datasheet.ciiva.com/22749/1720528-22749449.pdf?src-supplier=Element14; ComponentLink3Description: https://datasheet.ciiva.com/22749/1720528-22749449.pdf?src-supplier=Element14
U2 = TJA1051T/3: Interface Circuit, 1-Trnsvr, PDSO8; Manufacturer: NXP Semiconductors; Manufacturer Part Number: TJA1051T/3,118; Package Body Material: Plastic; Channels: 1; Nominal Supply Voltage: 5V; Telecom IC Type: CAN TRANSCEIVER; Data Rate: 1000Mbps; Package Equivalence Code: SOP8,.25; Max Supply Current: 70uA; Qualification Status: Not Qualified; Supplier: Digikey; Supplier Part Number: 568-8684-1-ND; RoHS: Yes; Category: Interface ICs; Stock: 66000; Pricing: 1=1.58, 10=1.411, 25=1.3392, 100=1.1001, 250=1.02836, 500=0.90878, 1000=0.71746, 2500=0.66963, 5000=0.63615, 12500=0.61223 (USD); Case/Package: SOP; Pins: 8; Package Shape: Rectangular; Terminal Finish: Nickel; Min Operating Temperature: -40°C; Max Operating Temperature: 125°C; JESD-609 Code: e4; JESD-30 Code: R-PDSO-G8; Moisture Sensitivity Level: 1; Package Style: SMALL OUTLINEMeter; Surface Mount: Yes; Terminal Form: Gull Wing; Terminal Position: DUAL; Number of Transceivers: 1; Power Supplies: 5V; Length: 4.9mm; Width: 3.9mm; Height - Seated (Max): 1.75mm; Terminal Pitch: 1.27mm; Reach SVHC Compliant: Yes; RoHS Compliant: Yes; Temperature Grade: AUTOMOTIVE; ComponentLink1URL: https://datasheet.ciiva.com:443/pdfs/VipMasterIC/IC/PHGL/PHGLS22584/PHGLS22584-1.pdf?src-supplier=IHS+Markit; ComponentLink1Description: https://datasheet.ciiva.com:443/pdfs/VipMasterIC/IC/PHGL/PHGLS22584/PHGLS22584-1.pdf?src-supplier=IHS+Markit
U3 = ESDA6V1L-TP: Trans Voltage Suppressor Diode, 300W, Unidirectional, 2 Element, Silicon; Manufacturer: MCC; Package Body Material: Plastic; Number of Elements: 2; Time @ Peak Reflow Temperature-Max (s): 10s; Max Breakdown Voltage: 7.2V; Min Breakdown Voltage: 6.1V; Qualification Status: Not Qualified; Supplier: Digikey; Supplier Part Number: ESDA6V1L-TPCT-ND; Manufacturer Part Number: ESDA6V1L-TP; RoHS: Yes; Category: TVS Diodes; Stock: 12959; Pricing: 1=0.58, 10=0.36, 100=0.23, 500=0.1736, 1000=0.15536 (USD); Pins: 3; Package Shape: Rectangular; Terminal Finish: Tin; Diode Element Material: SILICON; Max Operating Temperature: 150°C; JESD-609 Code: e3; JESD-30 Code: R-PDSO-G3; Moisture Sensitivity Level: 1; Package Style: SMALL OUTLINEMeter; Peak Reflow Temperature (Cel): 260°C; Surface Mount: Yes; Terminal Form: Gull Wing; Terminal Position: DUAL; Diode Type: TRANS VOLTAGE SUPPRESSOR; Polarity: Unidirectional; Non-rep Peak Rev Power Dis-Max: 300W; Technology: AVALANCHE; Reach SVHC Compliant: Yes; RoHS Compliant: Yes; ComponentLink1URL: https://datasheet.ciiva.com:443/pdfs/VipMasterIC/IC/MCCC/MCCC-S-A0007919939/MCCC-S-A0007919939-1.pdf?src-supplier=IHS+Markit; ComponentLink1Description: https://datasheet.ciiva.com:443/pdfs/VipMasterIC/IC/MCCC/MCCC-S-A0007919939/MCCC-S-A0007919939-1.pdf?src-supplier=IHS+Markit; ComponentLink2URL: https://datasheet.ciiva.com/4511/esda6v1lsot-23-220527-4511298.pdf?src-supplier=Mouser; ComponentLink2Description: https://datasheet.ciiva.com/4511/esda6v1lsot-23-220527-4511298.pdf?src-supplier=Mouser; ComponentLink3URL: https://datasheet.ciiva.com/335/esda6v1lsot-23-335169.pdf?src-supplier=Digikey; ComponentLink3Description: https://datasheet.ciiva.com/335/esda6v1lsot-23-335169.pdf?src-supplier=Digikey; ComponentLink4URL: https://datasheet.ciiva.com/335/esda6v1lsot-23-335170.pdf?src-supplier=Digikey; ComponentLink4Description: https://datasheet.ciiva.com/335/esda6v1lsot-23-335170.pdf?src-supplier=Digikey; ComponentLink5URL: https://datasheet.ciiva.com/335/esda6v1lsot-23-335171.pdf?src-supplier=Digikey; ComponentLink5Description: https://datasheet.ciiva.com/335/esda6v1lsot-23-335171.pdf?src-supplier=Digikey
U4 = STM32G431C8T6: Microcontroller; Manufacturer: STMicroelectronics; Supplier: Digikey; Supplier Part Number: STM32G431C8T6-ND; Manufacturer Part Number: STM32G431C8T6; RoHS: Yes; Category: Microcontrollers; Stock: 1745; Pricing: 1=5.6, 10=3.797, 25=3.3284, 80=2.876, 230=2.57017, 440=2.48386 (USD); ComponentLink1URL: https://datasheet.ciiva.com:443/pdfs/VipMasterIC/IC/SGST/SGST-S-A0010030739/SGST-S-A0010102973-1.pdf?src-supplier=IHS+Markit; ComponentLink1Description: https://datasheet.ciiva.com:443/pdfs/VipMasterIC/IC/SGST/SGST-S-A0010030739/SGST-S-A0010102973-1.pdf?src-supplier=IHS+Markit